# EAGLE design sensor (EAGLE 9.6.2)

## Sheet 1 of 2
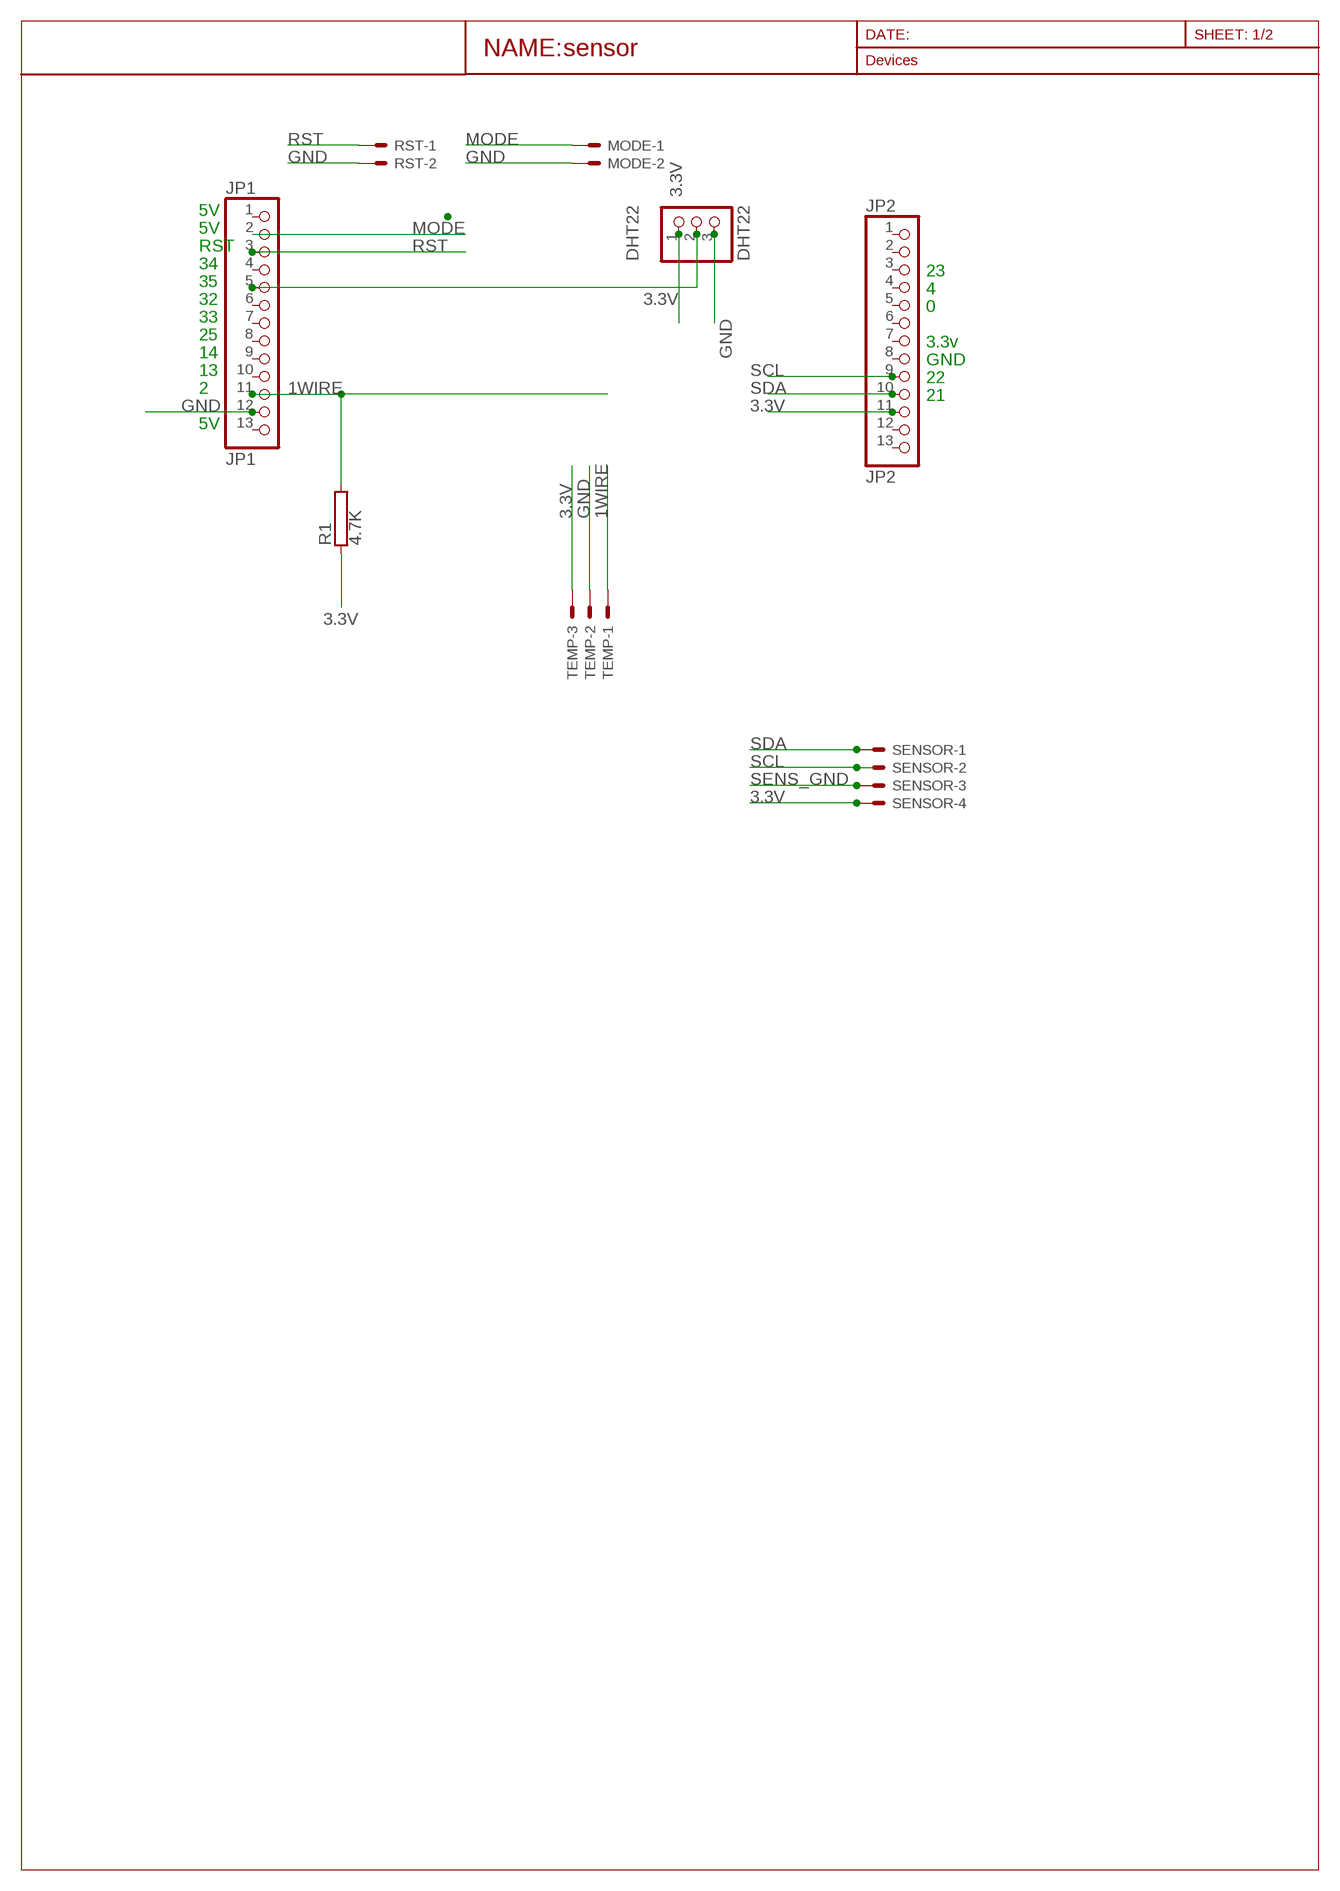
[diagram p0: schematic, sheet 1]

### Parts
DHT22  DHT22  PINHD-1X3  [1X03]
JP1  JP1  PINHD-1X13  [1X13]
JP2  JP2  PINHD-1X13  [1X13]
MODE  JST-XH-02-PIN-LONG-PAD  [JST-XH-02-PACKAGE-LONG-PAD]
R1  4.7K  RHPS58  [HPS58]
RST  JST-XH-02-PIN-LONG-PAD  [JST-XH-02-PACKAGE-LONG-PAD]
SENSOR  JST-XH-04-PIN-LONG-PAD  [JST-XH-04-PACKAGE-LONG-PAD]
TEMP  JST-XH-03-PIN-LONG-PAD  [JST-XH-03-PACKAGE-LONG-PAD]

### Nets
1WIRE [pwr]: JP1.11 R1.2 TEMP.1
3.3V [pwr]: DHT22.1 JP2.11 R1.1 SENSOR.4 TEMP.3
GND [pwr]: DHT22.3 JP1.12 MODE.2 RST.2 TEMP.2
MODE [pwr]: JP1.2 MODE.1
N$2: DHT22.2 JP1.5
RST [pwr]: JP1.3 RST.1
SCL [pwr]: JP2.9 SENSOR.2
SDA [pwr]: JP2.10 SENSOR.1
SENS_GND [pwr]: SENSOR.3
Unconnected: JP1.1 JP1.4 JP1.6 JP1.7 JP1.8 JP1.9 JP1.10 JP1.13 JP2.1 JP2.2 JP2.3 JP2.4 JP2.5 JP2.6 JP2.7 JP2.8 JP2.12 JP2.13

### Notes on the sheet
- 5V
- 5V
- RST
- 34
- 23
- 35
- 4
- 32
- 0
- 33
- 25
- 3.3v
- 14
- GND
- 13
- 22
- 2
- 21
- 5V

## Sheet 2 of 2

## Library data of the parts
DHT22 = adafruit:PINHD-1X3: PIN HEADER
JP1 JP2 = adafruit:PINHD-1X13: PIN HEADER
MODE RST = Rembrandt Electronics - JST XH Connectors v1-0:JST-XH-02-PIN: JST XH Connector 2 Pin Wire to board connector. Pitch: 2,54 mm, (0.100") Number of pins: 2 Created by Rembrandt Electronics www.rembrandtelectronics.com
R1 = resistor-power:R: Power Resitor; OC_FARNELL: unknown; OC_NEWARK: unknown
SENSOR = Rembrandt Electronics - JST XH Connectors v1-0:JST-XH-04-PIN: JST XH Connector 2 Pin Wire to board connector. Pitch: 2,54 mm, (0.100") Number of pins: 4 Created by Rembrandt Electronics www.rembrandtelectronics.com
TEMP = Rembrandt Electronics - JST XH Connectors v1-0:JST-XH-03-PIN: JST XH Connector 2 Pin Wire to board connector. Pitch: 2,54 mm, (0.100") Number of pins: 3 Created by Rembrandt Electronics www.rembrandtelectronics.com

## Module SWITCHES
Ports: 

### Library data of the parts

## Module POWER
Ports: VCC(io) 3.3V(io) GND(io) ENABLE(io)

### Library data of the parts

## Net classes
1 pwr: width 0.6 mm

## Board
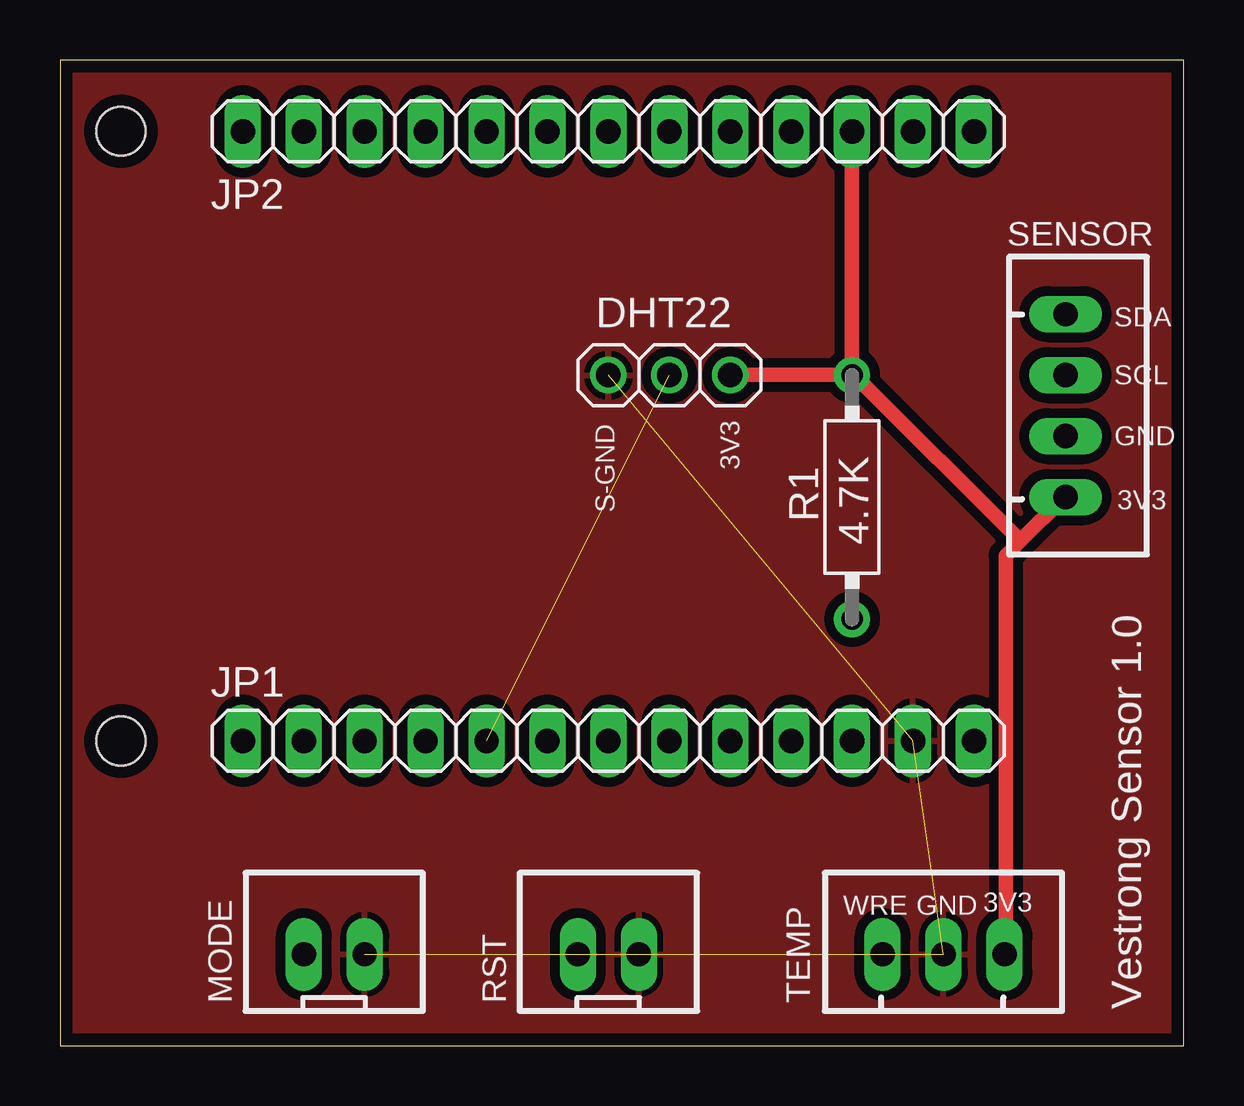
[diagram p1: board, top side]
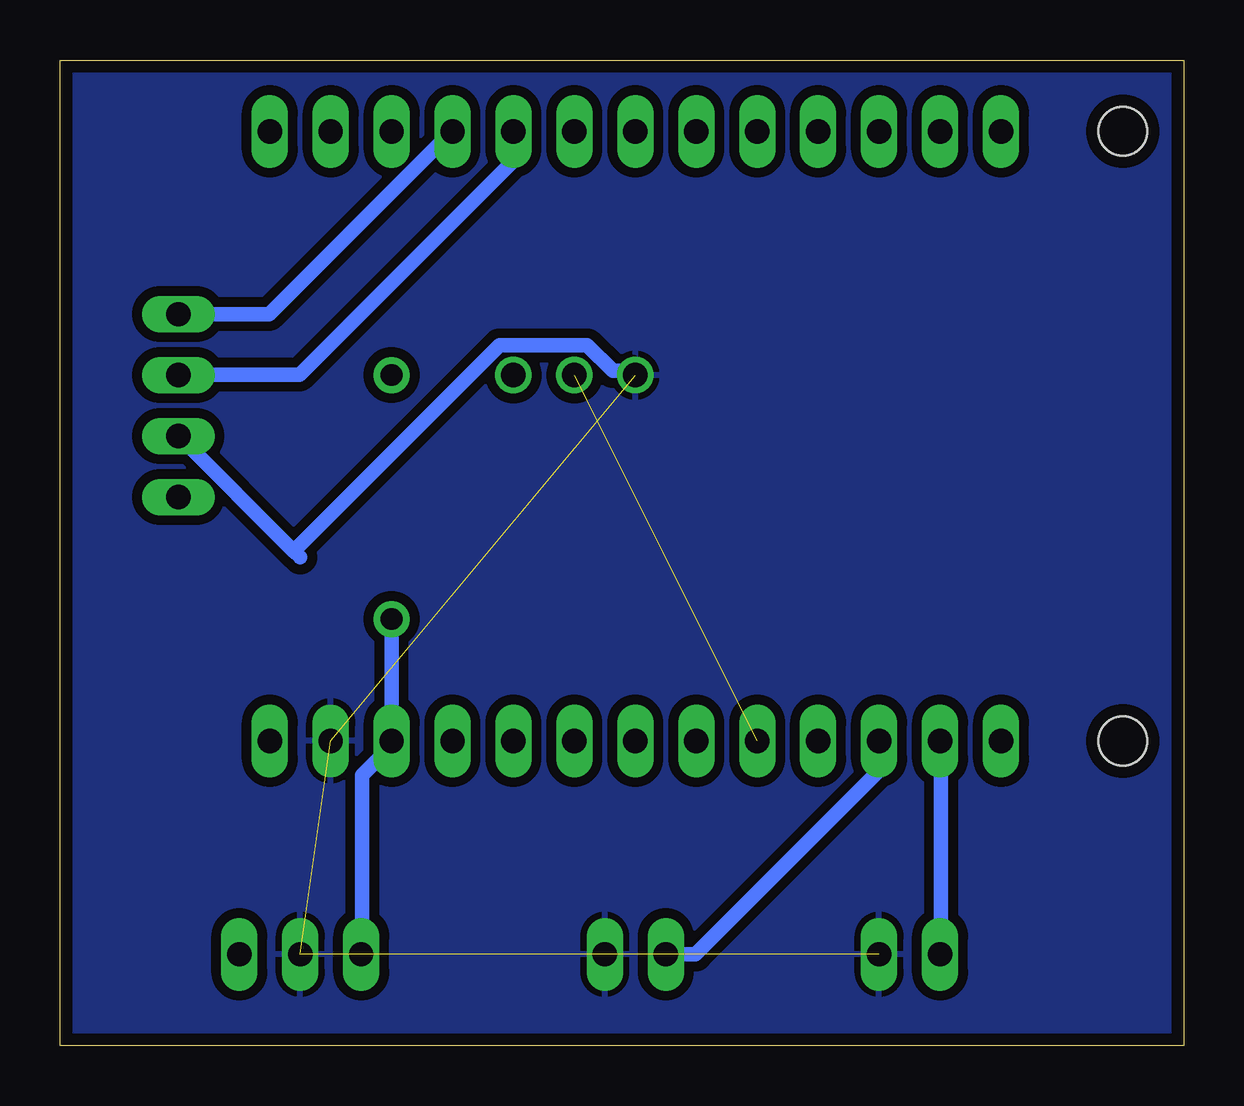
[diagram p2: board, bottom side, seen from below]

Size 46.84 x 41.07 mm. Coordinates in mm from the lower left corner, seen from the top.
Outline: 0,0 46.84,0 46.84,41.07 0,41.07 0,0
Copper layers (1*16): Top 0.035mm / dielectric 1.5mm / Bottom 0.035mm
Design rules "ShenZhen2U_2layer_EagleRules": minimum track width 7mil, minimum drill 12mil, track to track 7mil, track to pad 7mil, pad to pad 7mil, via to via 7mil, smd to smd 0mil, copper to edge 20mil, drill to drill 10mil, minimum pad ring 10mil, minimum via ring 6mil, stop-mask expansion 2mil, vias tented up to drill 25mil, thermal gap 10mil
Holes 2.03 mm at 2.54,12.7 2.54,38.1

### Footprints (pad centres in the part's own frame; a part is rotated, then mirrored left to right if it is on the bottom)
1X03 = drill 1.016: 1 -2.54,0; 2 0,0; 3 2.54,0
1X13 = drill 1.016 long: 1 -15.24,0; 2 -12.7,0; 3 -10.16,0; 4 -7.62,0; 5 -5.08,0; 6 -2.54,0; 7 0,0; 8 2.54,0; 9 5.08,0; 10 7.62,0; 11 10.16,0; 12 12.7,0; 13 15.24,0
JST-XH-02-PACKAGE-LONG-PAD = drill 1.016 long: 1 -1.27,0; 2 1.27,0
HPS58 = drill 0.9 pad 1.5: 1 -5.08,0; 2 5.08,0
JST-XH-04-PACKAGE-LONG-PAD = drill 1.016 long: 1 -3.81,0; 2 -1.27,0; 3 1.27,0; 4 3.81,0
JST-XH-03-PACKAGE-LONG-PAD = drill 1.016 long: 1 -2.54,0; 2 0,0; 3 2.54,0

### Placement (x,y rotation side)
DHT22  25.4,27.94 180 top
JP1  22.86,12.7 0 top
JP2  22.86,38.1 0 top
MODE  11.43,3.81 0 top
R1  33.02,22.86 270 top
RST  22.86,3.81 0 top
SENSOR  41.91,26.67 270 top
TEMP  36.83,3.81 0 top

### Tracks (layer width: path | path; a pad name or v marks a point on that pad's centre or on a via)
1WIRE
  Bottom 0.6: R1.2 JP1.11 33.1,12.42 34.24,11.28 34.24,3.83 TEMP.1
3.3V
  Top 0.6: R1.1 33.02,27.96 27.99,27.96 DHT22.1 | R1.1 JP2.11 | 40.03,21.03 41.86,22.86 SENSOR.4 | 40.03,21.03 39.42,20.42 39.42,3.83 TEMP.3 | 40.03,21.03 33.25,27.81 R1.1
GND  (4 unrouted)
  pour Bottom (isolate 0.406): 0,0 0,41.02 46.99,41.02 46.99,0
  pour Top (isolate 0.406): 0,41.02 46.99,41.02 46.99,0 0,0
MODE
  Bottom 0.6: MODE.1 10.13,3.82 10.13,12.62 JP1.2
N$2  (1 unrouted)
RST
  Bottom 0.6: RST.1 20.34,3.81 12.7,11.46 JP1.3
SCL
  Bottom 0.6: JP2.9 27.94,36.88 36.85,27.96 41.86,27.96 SENSOR.2
SDA
  Bottom 0.6: SENSOR.1 38.12,30.48 30.5,38.1 JP2.10
SENS_GND
  Bottom 0.6: 37.1,20.61 41.86,25.38 SENSOR.3 | 37.1,20.61 36.83,20.34 | 23.11,28.12 23.8,28.12 24.87,29.18 28.52,29.18 37.1,20.61

### Text on the board
tPlace: SDA | SCL | GND | 3V3 | S-GND | 3V3 | 3V3 | WRE | GND | Vestrong Sensor 1.0